# EAGLE design HAP-ControlUnit-3.0 (EAGLE 4.16)
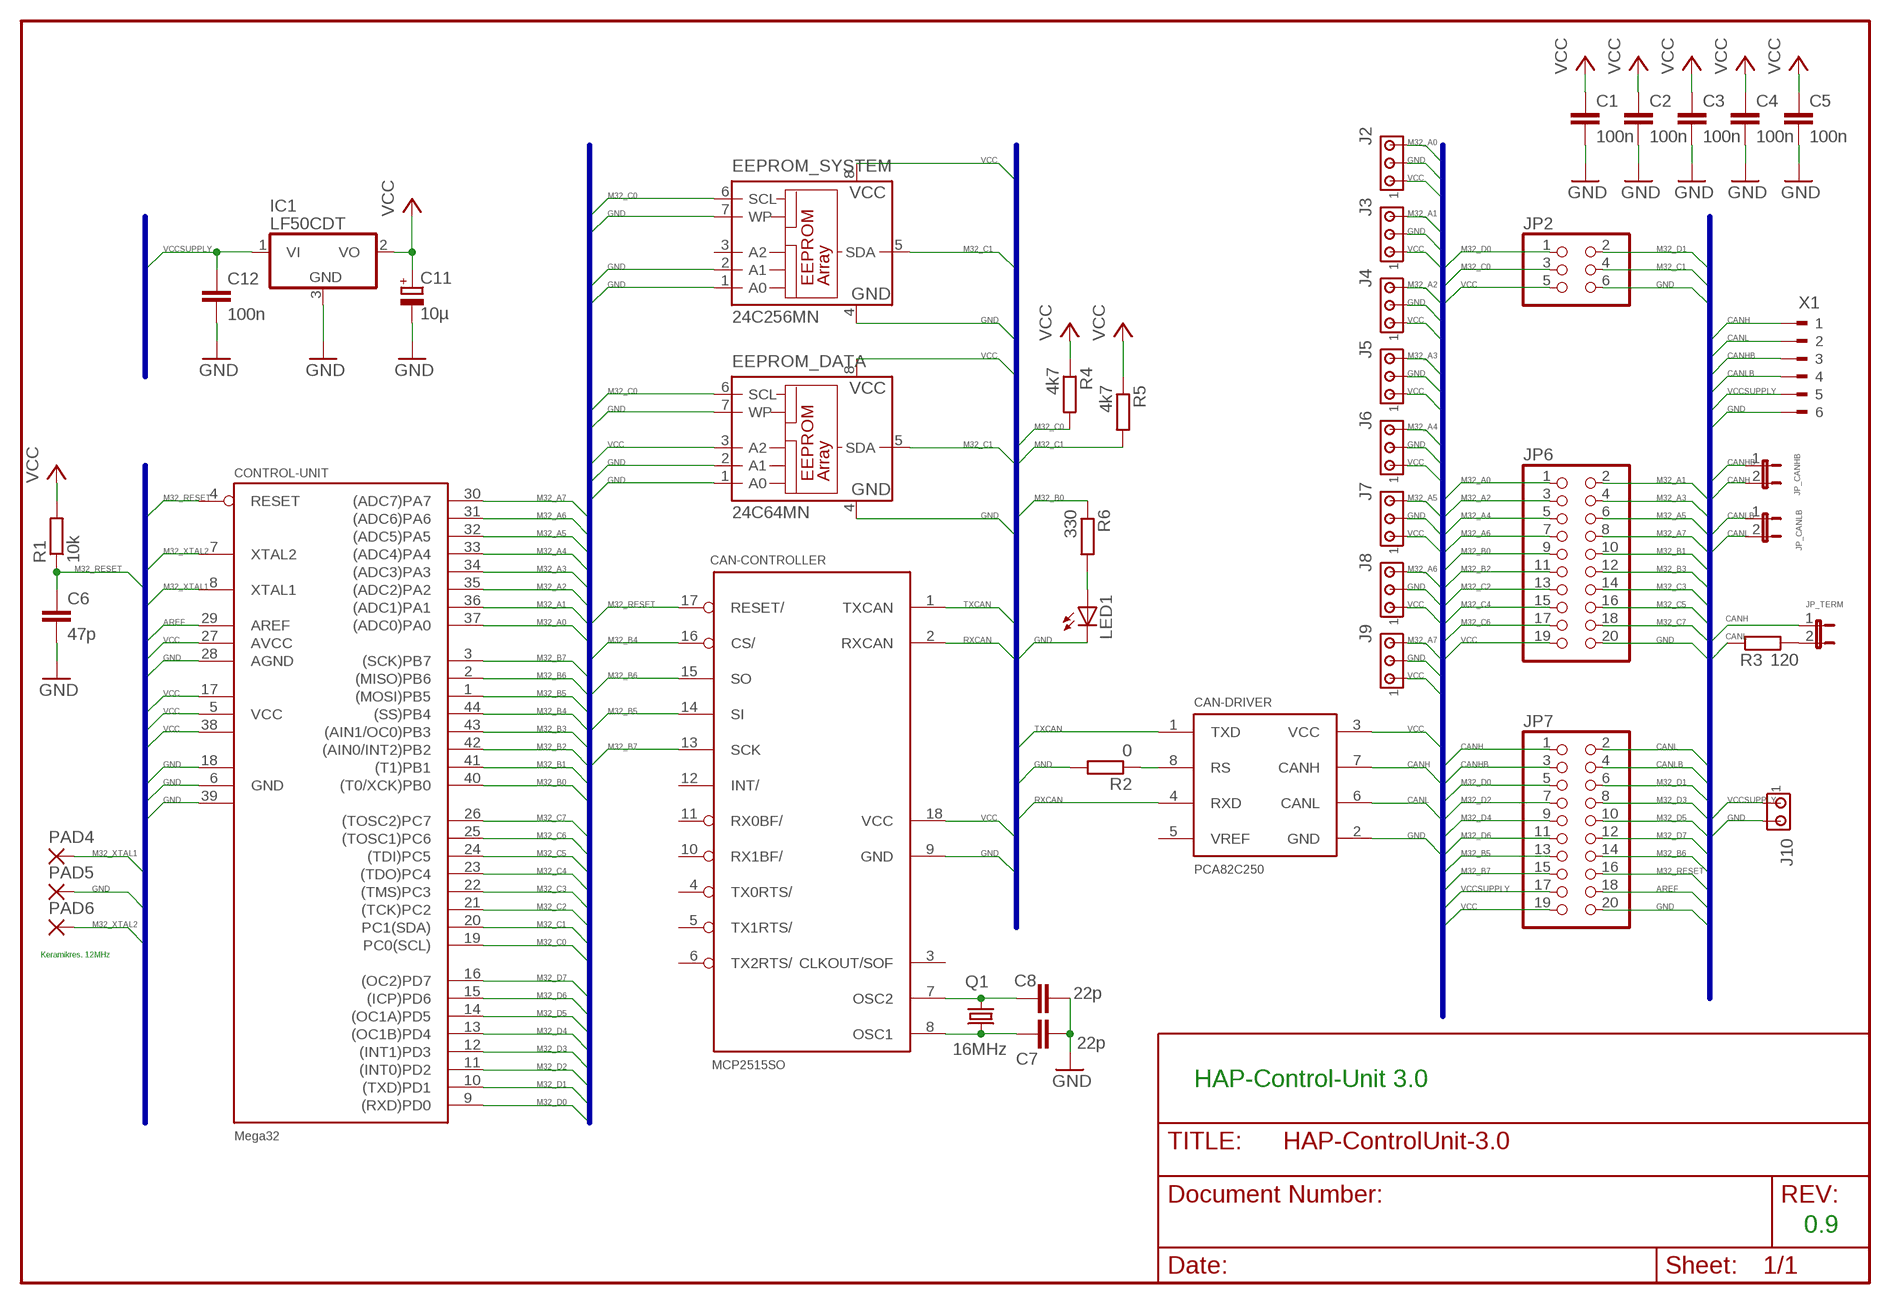
[diagram p0: schematic, sheet 1]

## Parts
C1  100n  C-EUC0805  [C0805]
C2  100n  C-EUC0805  [C0805]
C3  100n  C-EUC0805  [C0805]
C4  100n  C-EUC0805  [C0805]
C5  100n  C-EUC0805  [C0805]
C6  47p  C-EUC0805  [C0805]
C7  22p  C-EUC0805  [C0805]
C8  22p  C-EUC0805  [C0805]
C11  10µ  CPOL-EU153CLV-0405  [153CLV-0405]
C12  100n  C-EUC0805  [C0805]
CAN-CONTROLLER  MCP2515SO  [SO18L]
CAN-DRIVER  PCA82C250  PCA82C251SMD  [SO8]
CONTROL-UNIT  Mega32  MEGA32-A  [TQFP44]
EEPROM_DATA  24C64MN  24C32ASN  [SO-08]
EEPROM_SYSTEM  24C256MN  24C32ASN  [SO-08]
IC1  LF50CDT  7806DT  [TO252]
J2  MTA03-100  [10X03MTA]
J3  MTA03-100  [10X03MTA]
J4  MTA03-100  [10X03MTA]
J5  MTA03-100  [10X03MTA]
J6  MTA03-100  [10X03MTA]
J7  MTA03-100  [10X03MTA]
J8  MTA03-100  [10X03MTA]
J9  MTA03-100  [10X03MTA]
J10  MTA02-100  [10X02MTA]
JP2  PINHD-2X3  [2X03]
JP6  PINHD-2X10  [2X10]
JP7  PINHD-2X10  [2X10]
JP_CANHB  JP1E  [JP1]
JP_CANLB  JP1E  [JP1]
JP_TERM  JP1E  [JP1]
LED1  LEDCHIP-LED0805  [CHIP-LED0805]
PAD4  1,6/0,9  [1,6/0,9]
PAD5  1,6/0,9  [1,6/0,9]
PAD6  1,6/0,9  [1,6/0,9]
Q1  16MHz  CRYTALHC49UP  [HC49UP]
R1  10k  R-EU_R0805  [R0805]
R2  0  R-EU_R0805  [R0805]
R3  120  R-EU_R0805  [R0805]
R4  4k7  R-EU_R0805  [R0805]
R5  4k7  R-EU_R0805  [R0805]
R6  330  R-EU_R0805  [R0805]
X1  180-6  [180-6]

## Nets
AREF: CONTROL-UNIT.29(AREF) JP7.18
CANH: CAN-DRIVER.7(CANH) JP7.1 JP_CANHB.2 JP_TERM.1 X1.1
CANHB: JP7.3 JP_CANHB.1 X1.3
CANL: CAN-DRIVER.6(CANL) JP7.2 JP_CANLB.2 R3.1 X1.2
CANLB: JP7.4 JP_CANLB.1 X1.4
GND [VCC_GND]: C1.2 C2.2 C3.2 C4.2 C5.2 C6.2 C7.2 C8.2 C11.- C12.2 CAN-CONTROLLER.9(GND) CAN-DRIVER.2(GND) CONTROL-UNIT.6(GND) CONTROL-UNIT.18(GND1) CONTROL-UNIT.28(AGND) CONTROL-UNIT.39(GND2) EEPROM_DATA.1(A0) EEPROM_DATA.2(A1) EEPROM_DATA.4(GND) EEPROM_DATA.7(WP) EEPROM_SYSTEM.1(A0) EEPROM_SYSTEM.2(A1) EEPROM_SYSTEM.4(GND) EEPROM_SYSTEM.7(WP) IC1.3(GND) J2.2 J3.2 J4.2 J5.2 J6.2 J7.2 J8.2 J9.2 J10.2 JP2.6 JP6.20 JP7.20 LED1.C PAD5.1(P) R2.2 X1.6
M32_A0: CONTROL-UNIT.37((ADC0)PA0) J2.3 JP6.1
M32_A1: CONTROL-UNIT.36((ADC1)PA1) J3.3 JP6.2
M32_A2: CONTROL-UNIT.35((ADC2)PA2) J4.3 JP6.3
M32_A3: CONTROL-UNIT.34((ADC3)PA3) J5.3 JP6.4
M32_A4: CONTROL-UNIT.33((ADC4)PA4) J6.3 JP6.5
M32_A5: CONTROL-UNIT.32((ADC5)PA5) J7.3 JP6.6
M32_A6: CONTROL-UNIT.31((ADC6)PA6) J8.3 JP6.7
M32_A7: CONTROL-UNIT.30((ADC7)PA7) J9.3 JP6.8
M32_B0: CONTROL-UNIT.40((T0/XCK)PB0) JP6.9 R6.1
M32_B1: CONTROL-UNIT.41((T1)PB1) JP6.10
M32_B2: CONTROL-UNIT.42((AIN0/INT2)PB2) JP6.11
M32_B3: CONTROL-UNIT.43((AIN1/OC0)PB3) JP6.12
M32_B4: CAN-CONTROLLER.16(CS/) CONTROL-UNIT.44((SS)PB4)
M32_B5: CAN-CONTROLLER.14(SI) CONTROL-UNIT.1((MOSI)PB5) JP7.13
M32_B6: CAN-CONTROLLER.15(SO) CONTROL-UNIT.2((MISO)PB6) JP7.14
M32_B7: CAN-CONTROLLER.13(SCK) CONTROL-UNIT.3((SCK)PB7) JP7.15
M32_C0: CONTROL-UNIT.19(PC0(SCL)) EEPROM_DATA.6(SCL) EEPROM_SYSTEM.6(SCL) JP2.3 R4.2
M32_C1: CONTROL-UNIT.20(PC1(SDA)) EEPROM_DATA.5(SDA) EEPROM_SYSTEM.5(SDA) JP2.4 R5.2
M32_C2: CONTROL-UNIT.21((TCK)PC2) JP6.13
M32_C3: CONTROL-UNIT.22((TMS)PC3) JP6.14
M32_C4: CONTROL-UNIT.23((TDO)PC4) JP6.15
M32_C5: CONTROL-UNIT.24((TDI)PC5) JP6.16
M32_C6: CONTROL-UNIT.25((TOSC1)PC6) JP6.17
M32_C7: CONTROL-UNIT.26((TOSC2)PC7) JP6.18
M32_D0: CONTROL-UNIT.9((RXD)PD0) JP2.1 JP7.5
M32_D1: CONTROL-UNIT.10((TXD)PD1) JP2.2 JP7.6
M32_D2: CONTROL-UNIT.11((INT0)PD2) JP7.7
M32_D3: CONTROL-UNIT.12((INT1)PD3) JP7.8
M32_D4: CONTROL-UNIT.13((OC1B)PD4) JP7.9
M32_D5: CONTROL-UNIT.14((OC1A)PD5) JP7.10
M32_D6: CONTROL-UNIT.15((ICP)PD6) JP7.11
M32_D7: CONTROL-UNIT.16((OC2)PD7) JP7.12
M32_RESET: C6.1 CAN-CONTROLLER.17(RESET/) CONTROL-UNIT.4(RESET) JP7.16 R1.1
M32_XTAL1: CONTROL-UNIT.8(XTAL1) PAD4.1(P)
M32_XTAL2: CONTROL-UNIT.7(XTAL2) PAD6.1(P)
N$1: LED1.A R6.2
N$4: CAN-DRIVER.8(RS) R2.1
N$5: C7.1 CAN-CONTROLLER.8(OSC1) Q1.2
N$6: JP_TERM.2 R3.2
N$7: C8.1 CAN-CONTROLLER.7(OSC2) Q1.1
RXCAN: CAN-CONTROLLER.2(RXCAN) CAN-DRIVER.4(RXD)
TXCAN: CAN-CONTROLLER.1(TXCAN) CAN-DRIVER.1(TXD)
VCC [VCC_GND]: C1.1 C2.1 C3.1 C4.1 C5.1 C11.+ CAN-CONTROLLER.18(VCC) CAN-DRIVER.3(VCC) CONTROL-UNIT.5(VCC) CONTROL-UNIT.17(VCC1) CONTROL-UNIT.27(AVCC) CONTROL-UNIT.38(VCC2) EEPROM_DATA.3(A2) EEPROM_DATA.8(VCC) EEPROM_SYSTEM.8(VCC) IC1.2(VO) J2.1 J3.1 J4.1 J5.1 J6.1 J7.1 J8.1 J9.1 JP2.5 JP6.19 JP7.19 R1.2 R4.1 R5.1
VCCSUPPLY [VCC_GND]: C12.1 IC1.1(VI) J10.1 JP7.17 X1.5
Unconnected: CAN-CONTROLLER.3(CLKOUT/SOF) CAN-CONTROLLER.4(TX0RTS/) CAN-CONTROLLER.5(TX1RTS/) CAN-CONTROLLER.6(TX2RTS/) CAN-CONTROLLER.10(RX1BF/) CAN-CONTROLLER.11(RX0BF/) CAN-CONTROLLER.12(INT/) CAN-DRIVER.5(VREF) EEPROM_SYSTEM.3(A2)

## Buses
M32_RESET,M32_XTAL2,M32_XTAL1,M32_AREF,M32_AVCC,M32_AGND,M32_A[0..7],M32_B[0..7],M32_C[0..7],M32_D[0..7],VCC,GND,TXCAN,RXCAN,CANH,CANHB,CANL,CANLB,VCCSUPPLY,M32_XTAL1,M32_XTAL2,MCP_OSC1,MCP_OSC2,AREF

## Notes on the sheet
- Keramikres. 12MHz
- HAP-Control-Unit 3.0
- 0.9

## Library data of the parts
C1-C8 C12 = rcl:C-EU: CAPACITOR, European symbol
C11 = rcl:CPOL-EU: POLARIZED CAPACITOR, European symbol
CAN-CONTROLLER = MCP2515_MT:MCP2515*: MCP2515 Standalone CAN-Controller by Microchip Eagle-Lib. by MartinThomas
CAN-DRIVER = 82C250SMD:PCA82C251SMD
CONTROL-UNIT = atmel:MEGA32: MICROCONTROLLER 32 Kbytes FLASH 2 Kbytes SRAM 1 Kbytes EEPROM USART 8-channel 10 bit ADC Source: www.atmel.com .. doc2503.pdf
EEPROM_DATA EEPROM_SYSTEM = microchip:24*: Serial EEPROM I2C
IC1 = linear:78*: Positive VOLTAGE REGULATOR Source: http://cache.national.com/ds/LM/LM78L05.pdf http://www.fairchildsemi.com/ds/LM/LM7805.pdf
J2-J9 = con-amp:MTA03-100: AMP connector
J10 = con-amp:MTA02-100: AMP connector
JP2 = pinhead:PINHD-2X3: PIN HEADER
JP6 JP7 = pinhead:PINHD-2X10: PIN HEADER
JP_CANHB JP_CANLB JP_TERM = jumper:JP1E: JUMPER
LED1 = led:LED: LED OSRAM: - CHIPLED LG R971, LG N971, LY N971, LG Q971, LY Q971, LO R971, LY R971 LH N974, LH R974 LS Q976, LO Q976, LY Q976 LO Q996 - Hyper CHIPLED LW Q18S LB Q993, LB Q99A, LB R99A - SideLED LS A670, LO A670, LY A670, LG A670, LP A670 LB A673, LV A673, LT A673, LW A673 LH A674 LY A675 LS A676, LA A676, LO A676, LY A676, LW A676 LS A679, LY A679, LG A679 - Hyper Micro SIDELED® LS Y876, LA Y876, LO Y876, LY Y876 LT Y87S - SmartLED LW L88C, LW L88S LB L89C, LB L89S, LG L890 LS L89K, LO L89K, LY L89K LS L896, LA L896, LO L896, LY L896 - TOPLED LS T670, LO T670, LY T670, LG T670, LP T670 LSG T670, LSP T670, LSY T670, LOP T670, LYG T670 LG T671, LOG T671, LSG T671 LB T673, LV T673, LT T673, LW T673 LH T674 LS T676, LA T676, LO T676, LY T676, LB T676, LH T676, LSB T676, LW T676 LB T67C, LV T67C, LT T67C, LS T67K, LO T67K, LY T67K, LW E67C LS E67B, LA E67B, LO E67B, LY E67B, LB E67C, LV E67C, LT E67C LW T67C LS T679, LY T679, LG T679 LS T770, LO T770, LY T770, LG T770, LP T770 LB T773, LV T773, LT T773, LW T773 LH T774 LS E675, LA E675, LY E675, LS T675 LS T776, LA T776, LO T776, LY T776, LB T776 LHGB T686 LT T68C, LB T68C - Hyper Mini TOPLED® LB M676 - Mini TOPLED Santana® LG M470 LS M47K, LO M47K, LY M47K Source: http://www.osram.convergy.de/
PAD4-PAD6 = wirepad:1,6/0,9: THROUGH-HOLE PAD
Q1 = crystal:CRYTAL: CRYSTAL
R1-R6 = rcl:R-EU_: RESISTOR, European symbol
X1 = con-weidmueller-sl35:180-6: WEIDMUELLER CLAMP CONNECTOR

## Net classes
1 VCC_GND: width 0.305 mm, drill 0.203 mm

## Board
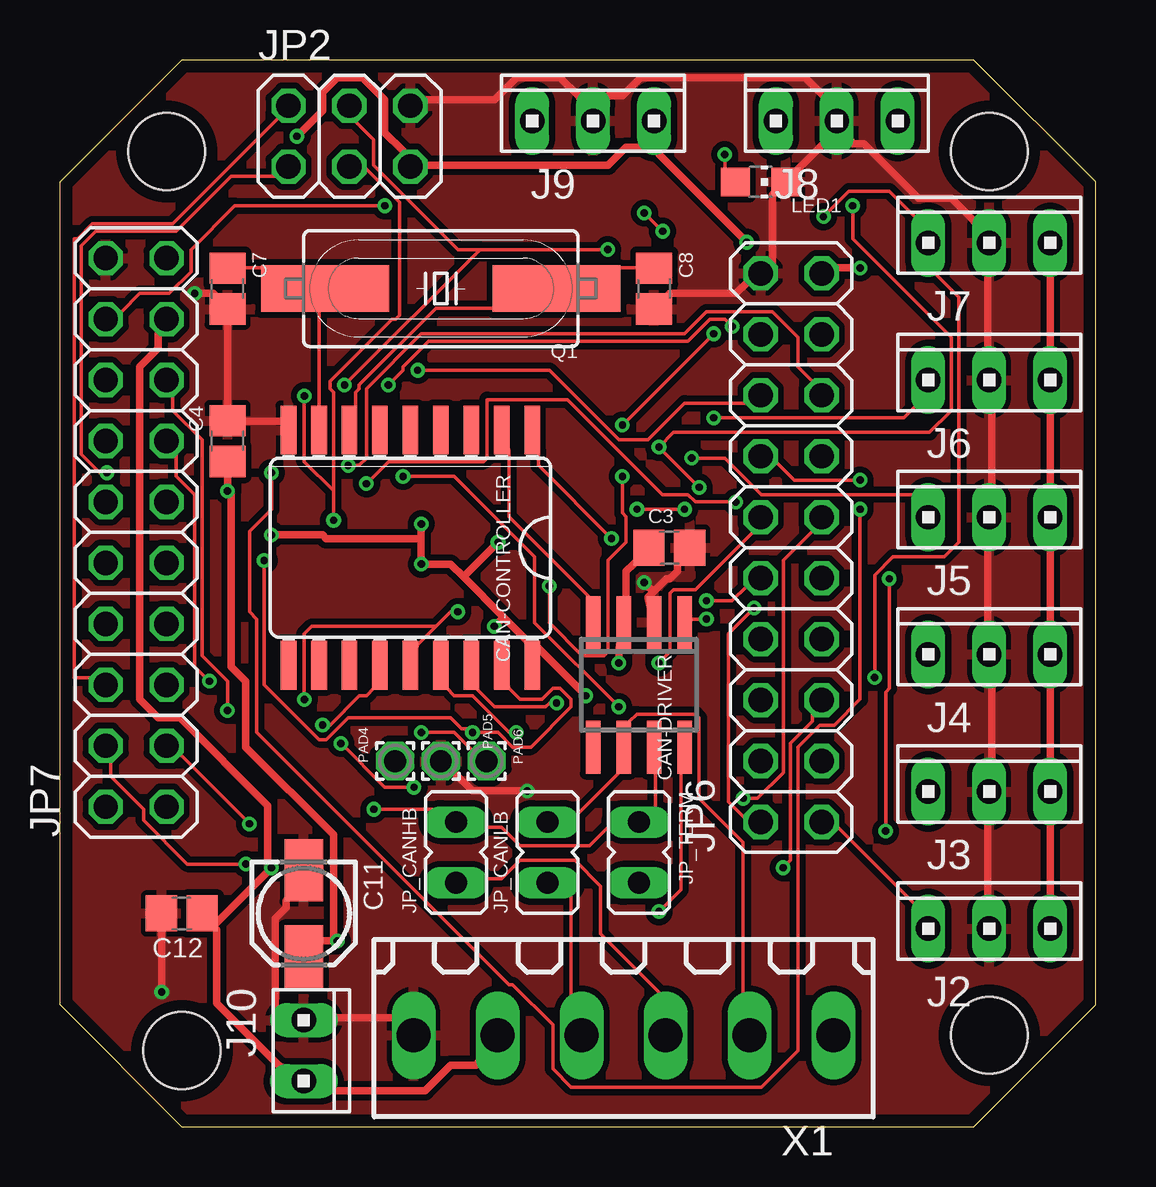
[diagram p1: board, top side]
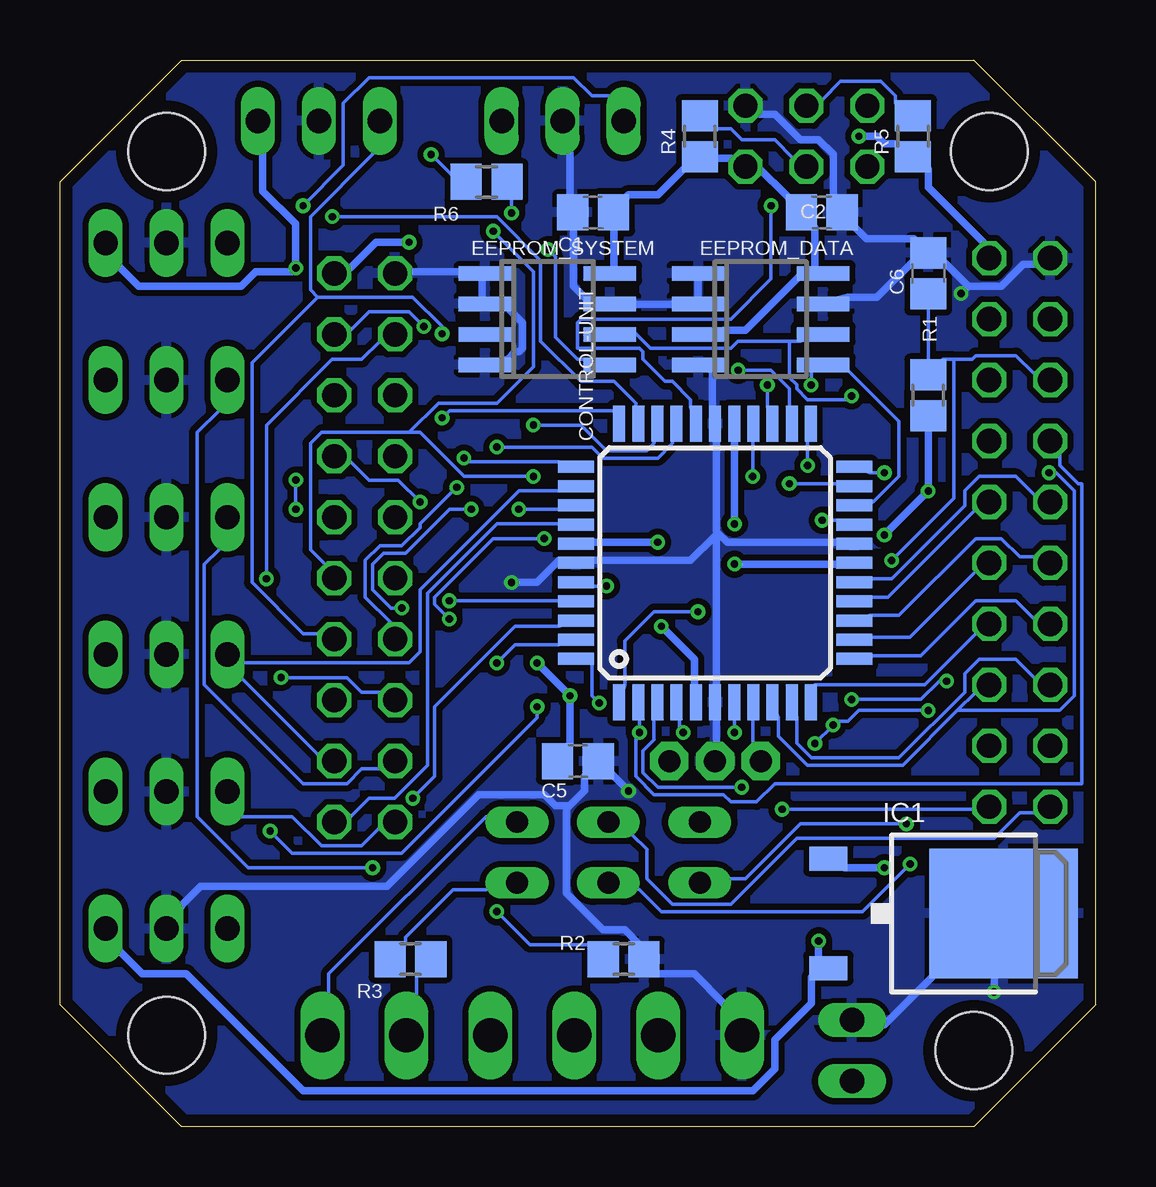
[diagram p2: board, bottom side, seen from below]

Size 43.18 x 44.45 mm. Coordinates in mm from the lower left corner, seen from the top.
Outline: 5.08,0 38.1,0 43.18,5.08 43.18,39.37 38.1,44.45 5.08,44.45 0,39.37 0,5.08 5.08,0
Copper layers (1*16): Top 0.035mm / dielectric 1.5mm / Bottom 0.035mm
Design rules "leiton": minimum track width 6mil, minimum drill 12mil, track to track 6mil, track to pad 6mil, pad to pad 6mil, via to via 6mil, smd to smd 6mil, copper to edge 20mil, drill to drill 8mil, minimum pad ring 8mil, minimum via ring 6mil, stop-mask expansion 3mil, vias tented up to drill 0mil, thermal gap 8mil
Holes 3.2 mm at 4.45,40.64 38.73,3.81 5.08,3.18 38.73,40.64

### Footprints (pad centres in the part's own frame; a part is rotated, then mirrored left to right if it is on the bottom)
C0805 = smd 1.3 x 1.5: 1 -0.85,0; 2 0.85,0
153CLV-0405 = smd 2.6 x 1.6: + 1.8,0; - -1.8,0
SO18L = smd 0.66 x 2.032: 1 -5.08,-4.902; 2 -3.81,-4.902; 3 -2.54,-4.902; 4 -1.27,-4.902; 5 0,-4.902; 6 1.27,-4.902; 7 2.54,-4.902; 8 3.81,-4.902; 9 5.08,-4.902; 10 5.08,4.902; 11 3.81,4.902; 12 2.54,4.902; 13 1.27,4.902; 14 0,4.902; 15 -1.27,4.902; 16 -2.54,4.902; 17 -3.81,4.902; 18 -5.08,4.902
SO8 = smd 0.6 x 2.2: 1 -1.905,-2.6; 2 -0.635,-2.6; 3 0.635,-2.6; 4 1.905,-2.6; 5 1.905,2.6; 6 0.635,2.6; 7 -0.635,2.6; 8 -1.905,2.6
TQFP44 = smd 1.5 x 0.5: 1 -5.8,4; 2 -5.8,3.2; 3 -5.8,2.4; 4 -5.8,1.6; 5 -5.8,0.8; 6 -5.8,0; 7 -5.8,-0.8; 8 -5.8,-1.6; 9 -5.8,-2.4; 10 -5.8,-3.2; 11 -5.8,-4; 23 5.8,-4; 24 5.8,-3.2; 25 5.8,-2.4; 26 5.8,-1.6; 27 5.8,-0.8; 28 5.8,0; 29 5.8,0.8; 30 5.8,1.6; 31 5.8,2.4; 32 5.8,3.2; 33 5.8,4 | smd 0.5 x 1.5: 12 -4,-5.8; 13 -3.2,-5.8; 14 -2.4,-5.8; 15 -1.6,-5.8; 16 -0.8,-5.8; 17 0,-5.8; 18 0.8,-5.8; 19 1.6,-5.8; 20 2.4,-5.8; 21 3.2,-5.8; 22 4,-5.8; 34 4,5.8; 35 3.2,5.8; 36 2.4,5.8; 37 1.6,5.8; 38 0.8,5.8; 39 0,5.8; 40 -0.8,5.8; 41 -1.6,5.8; 42 -2.4,5.8; 43 -3.2,5.8; 44 -4,5.8
SO-08 = smd 0.6 x 2.2: 1 -1.905,-2.6; 2 -0.635,-2.6; 3 0.635,-2.6; 4 1.905,-2.6; 5 1.905,2.6; 6 0.635,2.6; 7 -0.635,2.6; 8 -1.905,2.6
TO252 = smd 1 x 1.6: 1 -2.28,-4.8; 2 2.28,-4.8 | smd 5.4 x 6.2: 3 0,2.5
10X03MTA = drill 1.016 long: 1 2.54,0; 2 0,0; 3 -2.54,0
10X02MTA = drill 1.016 long: 1 1.27,0; 2 -1.27,0
2X03 = drill 1.016 octagon: 1 -2.54,-1.27; 2 -2.54,1.27; 3 0,-1.27; 4 0,1.27; 5 2.54,-1.27; 6 2.54,1.27
2X10 = drill 1.016 octagon: 1 -11.43,-1.27; 2 -11.43,1.27; 3 -8.89,-1.27; 4 -8.89,1.27; 5 -6.35,-1.27; 6 -6.35,1.27; 7 -3.81,-1.27; 8 -3.81,1.27; 9 -1.27,-1.27; 10 -1.27,1.27; 11 1.27,-1.27; 12 1.27,1.27; 13 3.81,-1.27; 14 3.81,1.27; 15 6.35,-1.27; 16 6.35,1.27; 17 8.89,-1.27; 18 8.89,1.27; 19 11.43,-1.27; 20 11.43,1.27
JP1 = drill 0.914 long: 1 0,-1.27; 2 0,1.27
CHIP-LED0805 = smd 1.2 x 1.2: A 0,-1.05; C 0,1.05
1,6/0,9 = drill 0.914 pad 1.6 octagon: 1 0,0
HC49UP = smd 5.334 x 1.93: 1 -4.826,0; 2 4.826,0
R0805 = smd 1.3 x 1.5: 1 -0.85,0; 2 0.85,0
180-6 = drill 1.422 long: 1 -8.75,0; 2 -5.25,0; 3 -1.75,0; 4 1.75,0; 5 5.25,0; 6 8.75,0

### Placement (x,y rotation side)
C1  20.96,38.1 180 bottom
C2  11.43,38.1 0 bottom
C3  25.4,24.13 0 top
C4  6.99,28.58 90 top
C5  21.59,15.24 0 bottom
C6  6.99,35.56 90 bottom
C7  6.99,34.93 270 top
C8  24.77,34.93 270 top
C11  10.16,8.89 270 top
C12  5.08,8.89 180 top
CAN-CONTROLLER  14.61,24.13 180 top
CAN-DRIVER  24.13,18.41 180 top
CONTROL-UNIT  15.88,23.5 90 bottom
EEPROM_DATA  13.97,33.66 270 bottom
EEPROM_SYSTEM  22.86,33.66 270 bottom
IC1  6.35,8.89 270 bottom
J2  38.73,8.26 0 top
J3  38.73,13.97 0 top
J4  38.73,19.69 0 top
J5  38.73,25.4 0 top
J6  38.73,31.12 0 top
J7  38.73,36.83 0 top
J8  32.39,41.91 0 top
J9  22.23,41.91 0 top
J10  10.16,3.18 270 top
JP2  12.06,41.28 0 top
JP6  30.48,24.13 90 top
JP7  3.18,24.77 90 top
JP_CANHB  16.51,11.43 0 top
JP_CANLB  20.32,11.43 0 top
JP_TERM  24.13,11.43 180 top
LED1  29.21,39.37 270 top
PAD4  13.97,15.24 0 top
PAD5  15.88,15.24 180 top
PAD6  17.78,15.24 180 top
Q1  15.88,34.93 180 top
R1  6.99,30.48 270 bottom
R2  19.69,6.99 0 bottom
R3  28.58,6.99 180 bottom
R4  16.51,41.28 90 bottom
R5  7.62,41.28 90 bottom
R6  25.4,39.37 180 bottom
X1  23.5,3.81 180 top

### Tracks (layer width: path | path; a pad name or v marks a point on that pad's centre or on a via)
AREF  (via drill 0.3)
  Top 0.152: v13.54,38.38 7.29,38.38 5.46,36.55 5.46,35.64 4.55,34.72 3.33,34.72 2.57,33.96 JP7.18
  Bottom 0.152: v13.54,38.38 13.54,35.33 15.22,33.66 21.46,33.66 21.62,33.5 21.62,32.44 19.02,32.44 18.87,32.28 18.87,31.98 17.96,31.06 17.65,31.06 16.89,30.3 16.89,30 CONTROL-UNIT.29
CANH  (via drill 0.3)
  Top 0.152: CAN-DRIVER.7 24.82,14.76 24.82,13.23 JP_TERM.1 22.84,12.47 22.07,11.71 19.18,11.71 18.41,12.47 17.8,12.47 JP_CANHB.2 15.52,13.23 v13.08,13.23
  Bottom 0.152: v13.08,13.23 5,13.23 JP7.1 | X1.1 31.98,5.61 31.98,6.38 25.43,12.93 JP_TERM.1
CANHB  (via drill 0.3)
  Top 0.152: JP_CANHB.1 17.8,10.34 18.41,10.34 19.18,11.1 21.46,11.1 22.53,10.03 22.53,8.05 24.97,5.61 X1.3 | v7.9,12.62 5,15.52 JP7.3
  Bottom 0.152: v7.9,12.62 12.32,12.62 14.61,10.34 15.22,10.34 JP_CANHB.1
CANL
  Top 0.152: JP_CANLB.2 21.46,12.93 23.29,14.76 CAN-DRIVER.6 23.75,16.89 24.05,17.2 26.49,17.2 26.65,17.04 26.65,13.69 28.47,11.86 28.47,5.61 X1.2
  Bottom 0.152: R3.1 28.32,6.38 28.32,5.46 X1.2 | JP7.2 2.57,13.08 3.18,13.08 4.24,12.01 12.47,12.01 15.22,9.27 17.65,9.27 18.72,10.34 18.72,11.56 19.33,12.17 JP_CANLB.2
CANLB  (via drill 0.3)
  Top 0.152: JP_CANLB.1 21.31,9.58 21.31,5.46 X1.4 | v7.75,10.95 5.31,10.95 3.48,12.78 3.48,13.23 2.11,14.61 2.11,15.22 JP7.4
  Bottom 0.152: v7.75,10.95 9.73,8.97 18.11,8.97 19.02,9.88 JP_CANLB.1
GND  (via drill 0.3)
  Top 0.305: JP2.6 15.22,42.8 18.11,42.8 19.02,43.71 20.85,43.71 21.62,42.95 J9.2 22.84,42.95 23.44,42.95 24.21,43.71 31.06,43.71 31.83,42.95 J8.2 | CAN-CONTROLLER.9 9.27,29.39 7.6,29.39 C4.2 C7.2 6.38,34.72 v5.61,34.72 | 24.74,22.3 24.51,22.07 CAN-DRIVER.2 | 24.74,22.3 25.27,22.84 25.43,22.84 25.73,23.14 25.73,23.44 C3.2 | v24.36,22.68 24.74,22.3 | v4.24,5.61 4.24,8.2 C12.2 | C11.- 9.42,9.42 9.42,9.12 8.97,8.66 8.97,4.85 J10.2 11.56,4.55 13.84,4.55 X1.6 | J8.2 31.83,40.97 30.76,39.9 LED1.C 29.69,38.84 29.69,35.94 JP6.20 28.63,35.18 28.17,34.72 25.43,34.72 C8.2 | J2.2 38.68,9.58 38.68,12.62 J3.2 38.84,15.37 38.84,18.41 J4.2 38.68,21.01 38.68,24.05 J5.2 38.84,26.8 38.84,29.84 J6.2 38.68,32.44 38.68,35.48 J7.2 38.08,37.77 37.16,38.68 35.79,38.68 33.5,40.97 33.05,40.97 J8.2 | v19.48,13.99 17.2,13.99 16.43,14.76 PAD5.1
  Bottom 0.305: EEPROM_DATA.1 16.59,35.33 16.59,34.57 EEPROM_DATA.2 17.65,34.27 19.18,34.27 EEPROM_SYSTEM.7 21.31,34.57 21.77,35.03 21.77,37.47 C1.2 21.92,38.84 21.92,40.51 J9.2 | C6.2 7.6,37.01 9.58,37.01 10.03,37.47 C2.2 10.95,38.84 10.95,40.51 11.56,41.12 12.32,41.12 13.39,42.19 13.99,42.19 JP2.6 | EEPROM_DATA.7 10.34,34.57 9.12,34.57 7.6,36.09 C6.2 | 5.31,35.03 3.94,35.03 3.02,35.94 2.57,35.94 JP7.20 | 5.31,35.03 6.38,36.09 C6.2 | 5.31,35.03 v5.61,34.72 | PAD5.1 15.82,15.98 15.82,17.04 CONTROL-UNIT.6 15.82,18.41 15.82,24.51 15.9,24.59 | 15.75,24.74 15.82,24.82 15.82,28.63 CONTROL-UNIT.28 15.98,30 15.98,31.52 EEPROM_DATA.4 | 15.75,24.74 15.37,24.36 10.79,24.36 CONTROL-UNIT.18 | 15.9,24.59 16.89,23.6 21.01,23.6 CONTROL-UNIT.39 22.38,23.6 23.29,22.68 v24.36,22.68 | 15.9,24.59 15.75,24.74 | v4.24,5.61 4.24,6.22 IC1.3 6.83,6.22 8.81,4.24 J10.2 | X1.6 15.52,5.16 16.74,6.38 18.26,6.38 R2.2 19.02,7.6 19.63,8.2 20.55,8.2 22.07,9.73 22.07,13.23 22,13.31 | 22,13.31 21.31,13.99 21.31,14.61 C5.2 20.09,14.61 v19.48,13.99 | EEPROM_SYSTEM.4 24.51,31.98 24.21,32.28 24.05,32.28 23.9,32.44 23.9,33.5 24.51,34.11 EEPROM_SYSTEM.2 25.58,34.57 25.58,35.33 EEPROM_SYSTEM.1 26.49,35.64 28.63,35.64 JP6.20 | 22,13.31 22.07,13.39 22.53,13.39 22.99,13.84 25.73,13.84 29.54,10.03 37.31,10.03 38.08,9.27 J2.2
  pour Bottom (isolate 0.254): 0,39.37 5.08,44.45 38.1,44.45 43.18,39.37 43.18,5.08 38.1,0 5.08,0 0,5.08
  pour Top (isolate 0.254): 0,39.37 5.08,44.45 38.1,44.45 43.18,39.37 43.18,5.08 38.1,0 5.08,0 0,5.08
M32_A0
  Top 0.152: J2.3 35.64,9.27 32.44,12.47 JP6.1
  Bottom 0.152: CONTROL-UNIT.37 22.38,25.12 24.97,25.12 27.86,22.23 27.86,15.06 29.23,13.69 30.3,13.69 31.06,12.93 JP6.1
M32_A1  (via drill 0.3)
  Top 0.152: v26.04,25.73 v24.05,25.73 | v28.93,21.62 27.86,20.55 27.86,13.54 28.63,12.78 JP6.2
  Bottom 0.152: v24.05,25.73 22.38,25.73 CONTROL-UNIT.36 | v26.04,25.73 26.95,25.73 28.78,23.9 29.69,23.9 30.15,23.44 30.15,22.38 29.39,21.62 v28.93,21.62 | J3.3 35.64,12.93 33.5,12.93 32.28,11.71 30.61,11.71 29.84,12.47 JP6.2
M32_A2
  Bottom 0.152: CONTROL-UNIT.35 22.38,26.49 24.05,26.49 28.17,22.38 28.17,19.79 28.63,19.33 35.64,19.33 J4.3 35.64,18.72 32.44,15.52 JP6.3
M32_A3  (via drill 0.3)
  Top 0.152: v26.34,27.86 27.71,27.86 29.23,26.34 35.64,26.34 J5.3
  Bottom 0.152: v26.34,27.86 26.19,27.71 22.38,27.71 CONTROL-UNIT.34 | JP6.4 29.84,14.91 30.61,14.91 31.22,14.3 33.05,14.3 37.16,18.41 37.16,23.44 36.55,24.05 J5.3
M32_A4  (via drill 0.3)
  Top 0.152: v27.25,29.54 35.18,29.54 35.64,30 J6.3 | v30.15,10.79 30.46,11.1 30.46,15.98 31.37,16.89 31.37,17.2 JP6.5
  Bottom 0.152: v27.25,29.54 26.95,29.84 20.09,29.84 CONTROL-UNIT.33 | v30.15,10.79 35.33,10.79 37.47,12.93 37.47,28.93 36.55,29.84 J6.3
M32_A5  (via drill 0.3)
  Top 0.152: v31.83,37.92 32.89,38.99 34.57,38.99 35.64,37.92 J7.3 36.55,35.48 37.47,34.57 37.47,24.36 36.86,23.75 34.72,23.75 33.96,22.99 v33.96,18.72
  Bottom 0.152: v31.83,37.92 24.97,37.92 23.14,36.09 23.14,32.74 21.46,31.06 20.09,31.06 19.18,30.15 19.18,30 CONTROL-UNIT.32 | v33.96,18.72 31.22,18.72 30.61,18.11 29.84,18.11 JP6.6
M32_A6  (via drill 0.3)
  Top 0.152: v23.44,29.23 v27.25,33.05
  Bottom 0.152: v23.44,29.23 21.46,29.23 20.4,28.17 18.72,28.17 18.41,28.47 18.41,28.63 CONTROL-UNIT.31 | v27.25,33.05 27.25,33.35 28.47,34.57 32.44,34.57 | 32.44,34.57 32.74,34.87 32.74,37.92 30.15,40.51 J8.3 | 32.44,34.57 35.18,31.83 35.18,22.68 33.05,20.55 32.44,20.55 JP6.7
M32_A7  (via drill 0.3)
  Top 0.152: v26.65,26.65 v24.97,28.32 25.58,28.93 36.25,28.93 37.16,29.84 37.16,32.89 33.05,37.01 v33.05,38.38
  Bottom 0.152: v24.97,28.32 21.01,28.32 20.55,27.86 18.26,27.86 17.65,28.47 17.65,28.63 CONTROL-UNIT.30 | v26.65,26.65 28.17,25.12 28.17,24.97 28.93,24.21 29.84,24.21 30.46,23.6 30.46,22.07 29.39,21.01 JP6.8 | v33.05,38.38 31.37,40.06 31.37,42.65 30.3,43.71 21.77,43.71 21.01,42.95 20.24,42.95 J9.3
M32_B0  (via drill 0.3)
  Top 0.152: v20.4,22.53 20.4,21.01 21.77,19.63 22.68,19.63 22.84,19.79 22.84,23.6 23.6,24.36 23.6,25.43 23.44,25.58 v23.44,27.1 | v25.12,37.31 v24.36,38.08
  Bottom 0.152: v20.4,22.53 21.01,22.53 CONTROL-UNIT.40 | v23.44,27.1 26.34,27.1 28.17,28.93 28.63,28.93 | 28.63,28.93 32.28,28.93 32.74,28.47 32.74,24.05 32.13,23.44 JP6.9 | v24.36,38.08 24.36,38.68 R6.1 | v25.12,37.31 23.44,35.64 23.44,31.67 24.97,30.15 27.41,30.15 28.63,28.93
M32_B1  (via drill 0.3)
  Top 0.152: v26.95,21.92 28.02,21.92 28.63,22.53 JP6.10
  Bottom 0.152: v26.95,21.92 22.38,21.92 CONTROL-UNIT.41
M32_B2  (via drill 0.3)
  Top 0.152: v28.47,13.69 29.08,13.69 30.15,14.76 30.15,23.6 31.37,24.82 JP6.11
  Bottom 0.152: v28.47,13.69 27.56,14.61 27.56,17.5 24.21,20.85 22.38,20.85 CONTROL-UNIT.42
M32_B3  (via drill 0.3)
  Top 0.152: v24.97,19.33 25.43,19.79 25.43,22.23 25.58,22.38 26.49,22.38 28.93,24.82 JP6.12
  Bottom 0.152: v24.97,19.33 24.21,20.09 22.38,20.09 CONTROL-UNIT.43
M32_B4  (via drill 0.3)
  Top 0.152: v20.7,17.65 20.4,17.65 20.24,17.5 18.11,17.5 17.35,18.26 CAN-CONTROLLER.16
  Bottom 0.152: v20.7,17.65 21.01,17.96 21.01,19.33 CONTROL-UNIT.44
M32_B5  (via drill 0.3)
  Top 0.152: v16.59,21.46 16.28,21.46 15.67,20.85 | 15.67,20.85 14.91,20.09 CAN-CONTROLLER.14 | v6.22,18.57 5.61,19.18 5.61,26.34 4.85,27.1 4.85,28.02 JP7.13 | v10.19,17.8 10.19,20.55 10.49,20.85 15.67,20.85
  Bottom 0.152: v16.59,21.46 18.41,21.46 19.63,20.24 19.63,18.41 CONTROL-UNIT.1 | v6.22,18.57 6.53,18.57 7.29,17.8 v10.19,17.8
M32_B6  (via drill 0.3)
  Top 0.152: v19.02,16.43 18.72,16.43 17.2,17.96 16.43,17.96 16.13,18.26 CAN-CONTROLLER.15
  Bottom 0.152: CONTROL-UNIT.2 19.02,17.04 v19.02,16.43 19.18,16.28 19.18,14.61 18.41,13.84 15.52,13.84 15.22,13.54 14.15,13.54 13.39,14.3 0.58,14.3 0.58,26.8 0.74,26.8 1.5,27.56 1.5,28.02 JP7.14
M32_B7  (via drill 0.3)
  Top 0.152: v14.76,14.15 13.54,14.15 v11.71,15.98 | v10.95,16.74 11.25,16.74 12.47,17.96 12.78,17.96 13.08,18.26 CAN-CONTROLLER.13 | v6.99,17.35 6.99,18.57 5.92,19.63 5.92,28.63 4.7,29.84 4.7,30.46 JP7.15
  Bottom 0.152: v14.76,14.15 18.26,14.15 18.87,14.76 18.87,15.67 18.41,16.13 18.41,17.04 CONTROL-UNIT.3 | v11.71,15.98 v10.95,16.74 10.79,16.89 10.34,16.89 9.88,17.35 v6.99,17.35
M32_C0  (via drill 0.3)
  Top 0.152: 11.4,26.49 11.4,30.61 11.25,30.76 11.25,31.06 13.84,33.66 13.99,33.66 14.15,33.81 14.15,38.53 12.62,40.06 JP2.3 | v11.4,25.27 11.4,26.49 | v10.19,30.46 10.19,27.71 11.4,26.49
  Bottom 0.152: 12.78,32.74 14.91,32.74 15.22,32.44 18.57,32.44 19.18,33.05 EEPROM_SYSTEM.6 | 12.78,32.74 12.32,32.74 EEPROM_DATA.6 | v11.4,25.27 10.79,25.27 CONTROL-UNIT.19 | R4.2 15.82,41.58 15.22,41.58 14.76,41.12 13.39,41.12 12.62,40.36 JP2.3 | 12.78,32.74 12.78,31.22 12.47,30.91 12.47,30.76 12.01,30.3 10.34,30.3 v10.19,30.46
M32_C1  (via drill 0.3)
  Top 0.152: 17.5,36.55 16.59,36.55 13.08,40.06 13.08,41.12 12.32,41.89 JP2.4 | 17.5,36.55 v22.84,36.55 | v11.86,30.91 17.5,36.55
  Bottom 0.152: CONTROL-UNIT.20 9.42,26.04 9.27,26.04 8.2,27.1 8.2,29.39 10.34,31.52 EEPROM_DATA.5 11.86,31.52 v11.86,30.91 | R5.2 8.36,42.65 8.36,42.95 8.97,43.56 10.64,43.56 11.4,42.8 JP2.4 | v22.84,36.55 22.53,36.25 22.53,32.89 21.62,31.98 21.31,31.98 EEPROM_SYSTEM.5
M32_C2  (via drill 0.3)
  Top 0.152: v12.78,26.8 13.69,27.71 17.65,27.71 17.8,27.86 17.8,30.3 21.16,30.3 25.12,26.34 26.19,26.34 26.49,26.04 v28.17,26.04
  Bottom 0.152: v12.78,26.8 10.79,26.8 CONTROL-UNIT.21 | v28.17,26.04 29.08,26.95 30.3,26.95 31.06,27.71 JP6.13
M32_C3  (via drill 0.3)
  Top 0.152: v8.81,27.25 8.81,25.73 7.9,24.82 7.9,21.46 8.2,21.16 8.2,16.43 18.72,5.92 18.87,5.92 20.55,4.24 20.55,2.41 21.31,1.65 29.23,1.65 30.76,3.18 30.76,15.82 31.67,16.74 32.28,16.74 33.35,17.8 v33.35,25.73 | v33.35,26.95 30.61,26.95 29.84,27.71 JP6.14
  Bottom 0.152: v8.81,27.25 9.42,27.25 CONTROL-UNIT.22 | v33.35,25.73 v33.35,26.95
M32_C4  (via drill 0.3)
  Top 0.152: v12.01,27.56 12.47,27.56 12.78,27.86 12.78,30.76 15.06,33.05 26.04,33.05 26.95,33.96 29.69,33.96 30.76,32.89 30.76,31.67 31.37,31.06 JP6.15
  Bottom 0.152: v12.01,27.56 12.01,28.63 CONTROL-UNIT.23
M32_C5  (via drill 0.3)
  Top 0.152: v14.91,31.52 20.4,31.52 23.29,28.63 24.51,28.63 26.04,30.15 28.63,30.15 JP6.16
  Bottom 0.152: v14.91,31.52 13.54,31.52 12.78,30.76 12.78,30 CONTROL-UNIT.24
M32_C6  (via drill 0.3)
  Top 0.152: v13.69,30.91 14.3,31.52 14.3,31.67 15.37,32.74 26.19,32.74 27.1,33.66 27.71,33.66 v28.02,33.35
  Bottom 0.152: v13.69,30.91 13.69,30 CONTROL-UNIT.25 | v28.02,33.35 28.63,33.96 30.3,33.96 31.06,33.2 JP6.17
M32_C7  (via drill 0.3)
  Top 0.152: v14.3,27.1 16.43,27.1 19.79,23.75 19.79,21.01 v23.29,17.5 | v34.42,12.32 34.42,18.11 34.57,18.26 v34.57,22.84
  Bottom 0.152: v14.3,27.1 14.3,28.63 CONTROL-UNIT.26 | v23.29,17.5 23.29,17.04 28.93,11.4 33.5,11.4 v34.42,12.32 | v34.57,22.84 34.57,29.23 31.83,31.98 30.61,31.98 29.84,32.74 JP6.18
M32_D0  (via drill 0.3)
  Top 0.152: v1.96,27.25 1.65,27.25 0.89,28.02 0.89,36.7 1.5,37.31 4.85,37.31 7.14,39.6 8.97,39.6 JP2.1
  Bottom 0.152: 5.77,17.35 5,18.11 JP7.5 | 5.77,17.35 8.05,15.06 12.01,15.06 13.23,16.28 13.23,17.04 CONTROL-UNIT.9 | v1.96,27.25 1.65,27.25 0.89,26.49 0.89,17.96 1.5,17.35 5.77,17.35
M32_D1
  Top 0.152: JP2.2 9.12,42.04 4.7,37.62 1.35,37.62 0.74,37.01 0.58,37.01 0.58,18.72 1.35,18.72 JP7.6
  Bottom 0.152: CONTROL-UNIT.10 12.47,17.04 12.47,15.98 11.86,15.37 8.2,15.37 5.46,18.11 5.46,18.87 4.85,19.48 3.33,19.48 2.57,18.72 JP7.6
M32_D2
  Bottom 0.152: CONTROL-UNIT.11 11.71,18.41 7.14,18.41 5,20.55 JP7.7
M32_D3
  Bottom 0.152: CONTROL-UNIT.12 9.42,19.63 7.29,19.63 5,21.92 3.33,21.92 2.57,21.16 JP7.8
M32_D4
  Bottom 0.152: CONTROL-UNIT.13 9.42,20.4 7.75,20.4 5,23.14 JP7.9
M32_D5
  Bottom 0.152: CONTROL-UNIT.14 9.42,21.31 8.2,21.31 5,24.51 3.94,24.51 3.18,23.75 2.57,23.75 JP7.10
M32_D6
  Bottom 0.152: CONTROL-UNIT.15 9.42,22.07 8.66,22.07 5,25.73 JP7.11
M32_D7
  Bottom 0.152: CONTROL-UNIT.16 9.42,22.84 8.51,22.84 5.46,25.88 5.46,26.49 4.85,27.1 3.33,27.1 2.57,26.34 JP7.12
M32_RESET  (via drill 0.3)
  Top 0.152: CAN-CONTROLLER.17 18.72,18.26 19.18,17.8 20.09,17.8 20.55,18.26 20.85,18.26 21.31,17.8 21.31,17.5 19.63,15.82 18.87,15.82 18.26,16.43 v17.2,16.43 17.04,16.59 16.74,16.59 16.28,17.04 12.01,17.04 11.1,16.13 10.79,16.13 8.51,18.41 v8.51,23.6
  Bottom 0.152: v17.2,16.43 17.35,16.59 17.35,17.04 CONTROL-UNIT.4 | C6.1 R1.1 6.38,31.98 5.92,31.98 | 5.92,31.98 5.16,31.98 5,32.13 3.33,32.13 2.57,31.37 JP7.16 | v8.51,23.6 5.92,26.19 5.92,31.98
M32_XTAL1
  Bottom 0.152: CONTROL-UNIT.8 14.3,17.04 14.3,15.98 PAD4.1
M32_XTAL2  (via drill 0.3)
  Top 0.152: v15.06,16.43 16.43,16.43 17.2,15.67 PAD6.1
  Bottom 0.152: v15.06,16.43 15.06,17.04 CONTROL-UNIT.7
N$1  (via drill 0.3)
  Top 0.152: v27.71,40.51 27.71,39.9 LED1.A
  Bottom 0.152: v27.71,40.51 26.8,39.6 R6.2
N$4  (via drill 0.3)
  Top 0.152: v24.97,8.97 25.88,9.88 25.88,14.76 CAN-DRIVER.8
  Bottom 0.152: v24.97,8.97 23.6,7.6 21.16,7.6 R2.1
N$5
  Top 0.152: C7.1 7.6,35.79 8.51,35.79 Q1.2 10.79,34.11 CAN-CONTROLLER.8
N$6
  Bottom 0.152: R3.2 28.78,7.6 28.78,7.9 26.8,9.88 25.43,9.88 JP_TERM.2
N$7
  Top 0.152: C8.1 24.05,35.79 23.29,35.79 Q1.1 18.11,34.11 15.67,34.11 12.47,30.91 12.47,30.76 12.32,30.61 12.32,30 CAN-CONTROLLER.7
RXCAN
  Top 0.152: CAN-CONTROLLER.2 18.72,28.17 18.72,25.43 22.07,22.07 CAN-DRIVER.4
TXCAN  (via drill 0.3)
  Top 0.152: v22.99,24.51 19.94,27.56 19.94,28.17 CAN-CONTROLLER.1 | v26.95,21.16 26.19,21.16 CAN-DRIVER.1
  Bottom 0.152: v22.99,24.51 25.12,24.51 27.56,22.07 27.56,21.77 v26.95,21.16
VCC  (via drill 0.3)
  Top 0.305: C4.1 v6.99,26.49 7.14,26.34 7.14,19.18 7.75,18.57 7.75,15.82 11.4,12.17 11.4,7.9 v11.56,7.75 10.95,7.75 C11.+ | C3.1 23.9,23.44 23.6,23.14 23.6,22.07 CAN-DRIVER.3 23.29,19.94 v23.29,19.33 | 18.49,21.23 19.63,20.09 CAN-CONTROLLER.18 19.94,19.94 v21.92,17.96 | 16.81,22.91 18.49,21.23 | 16.81,22.91 16.28,23.44 v15.06,23.44 15.06,24.51 | 15.06,24.51 v15.06,25.12 | 18.49,21.23 v18.11,20.85 | 16.81,22.91 v18.26,24.36 | v8.81,24.66 10.95,24.66 11.1,24.51 15.06,24.51 | v9.88,41.28 10.95,42.34 10.95,43.1 11.56,43.71 12.62,43.71 13.54,42.8 13.54,41.43 14.3,40.66 JP2.5 15.22,40.06 22.84,40.06 23.6,40.82 24.21,40.82 J9.1 24.97,40.51 v28.63,36.86 | J2.1 J3.1 J4.1 J5.1 J6.1 J7.1 | v33.35,35.79 32.44,35.79 JP6.19
  Bottom 0.305: R1.2 v6.99,26.49 v8.81,24.66 | v11.56,7.75 11.56,6.99 IC1.2 11.86,6.22 11.86,5.16 13.39,3.63 13.39,2.41 14.3,1.5 33.05,1.5 37.92,6.38 39.75,6.38 40.66,7.29 J2.1 | v15.06,23.44 10.79,23.44 CONTROL-UNIT.17 | v15.06,25.12 15.06,28.63 CONTROL-UNIT.27 | v18.11,20.85 16.74,19.48 16.74,18.41 CONTROL-UNIT.5 | v18.26,24.36 21.01,24.36 CONTROL-UNIT.38 | C5.1 21.92,15.98 v21.92,17.96 v23.29,19.33 | JP7.19 4.7,36.86 6.99,39.14 6.99,39.9 R5.1 8.36,40.97 8.81,40.97 9.12,41.28 v9.88,41.28 | EEPROM_SYSTEM.8 20.09,35.79 20.09,37.47 C1.1 19.48,38.84 18.26,38.84 17.2,39.9 R4.1 15.82,40.36 15.22,40.36 JP2.5 13.99,39.9 12.93,38.84 C2.1 11.71,37.47 11.71,35.79 EEPROM_DATA.8 12.32,35.48 14.61,33.2 15.52,33.2 EEPROM_DATA.3 | J8.1 34.72,40.51 34.72,38.99 33.35,37.62 v33.35,35.79 33.5,35.64 35.03,35.64 35.64,35.03 39.9,35.03 40.66,35.79 J7.1 | v28.63,36.86 30,36.86 31.06,35.79 JP6.19
VCCSUPPLY  (via drill 0.3)
  Top 0.305: JP7.17 4.09,33.05 4.09,32.44 3.33,31.67 3.33,17.8 4.09,17.04 5,17.04 8.66,13.39 8.66,10.95 v8.81,10.79 6.53,8.51 C12.1 6.53,8.2 6.53,5.16 9.12,2.57 J10.1 11.4,1.5 15.22,1.5 16.28,2.57 17.35,2.57 X1.5
  Bottom 0.305: v8.81,10.79 10.49,10.79 IC1.1